# EAGLE design M784bad (EAGLE 6.6.0)
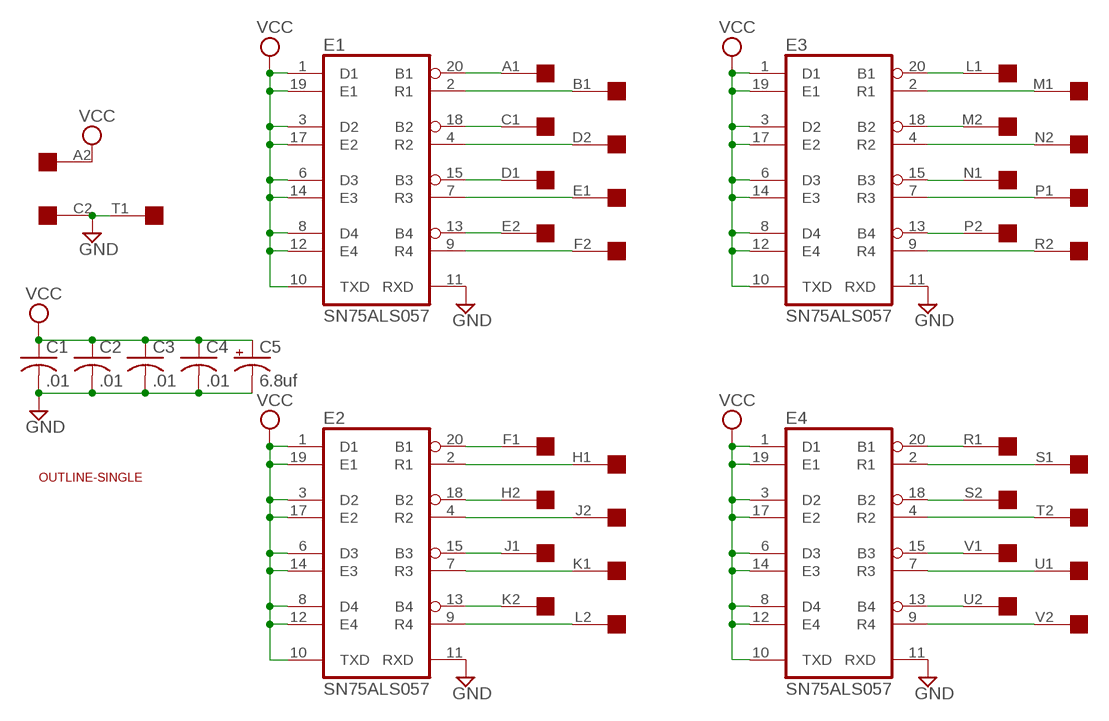
[diagram p0: schematic, sheet 1]

## Parts
C1  .01  C-US050-025X075  [C050-025X075]
C2  .01  C-US050-025X075  [C050-025X075]
C3  .01  C-US050-025X075  [C050-025X075]
C4  .01  C-US050-025X075  [C050-025X075]
C5  6.8uf  CPOL-USE15-5AXIAL  [E15-5]
E1  SN75ALS057  [DIL20]
E2  SN75ALS057  [DIL20]
E3  SN75ALS057  [DIL20]
E4  SN75ALS057  [DIL20]
U$1  SINGLE  [EDGE-CON2]
U$2  OUTLINE-SINGLE  [SINGLE]

## Nets
GND: C1.2 C2.2 C3.2 C4.2 C5.- E1.11(RXD) E2.11(RXD) E3.11(RXD) E4.11(RXD) U$1.C2 U$1.T1
N$1: E3.20(B1) U$1.L1
N$2: E3.2(R1) U$1.M1
N$3: E3.18(B2) U$1.M2
N$4: E3.4(R2) U$1.N2
N$5: E3.15(B3) U$1.N1
N$6: E3.7(R3) U$1.P1
N$7: E3.13(B4) U$1.P2
N$8: E3.9(R4) U$1.R2
N$9: E4.9(R4) U$1.V2
N$10: E4.13(B4) U$1.U2
N$11: E4.7(R3) U$1.U1
N$12: E4.15(B3) U$1.V1
N$13: E4.4(R2) U$1.T2
N$14: E4.18(B2) U$1.S2
N$15: E4.20(B1) U$1.R1
N$16: E4.2(R1) U$1.S1
N$17: E2.13(B4) U$1.K2
N$18: E2.9(R4) U$1.L2
N$19: E2.7(R3) U$1.K1
N$20: E2.15(B3) U$1.J1
N$21: E2.4(R2) U$1.J2
N$22: E2.18(B2) U$1.H2
N$23: E2.2(R1) U$1.H1
N$24: E2.20(B1) U$1.F1
N$25: E1.9(R4) U$1.F2
N$26: E1.13(B4) U$1.E2
N$27: E1.7(R3) U$1.E1
N$28: E1.15(B3) U$1.D1
N$29: E1.4(R2) U$1.D2
N$30: E1.18(B2) U$1.C1
N$31: E1.2(R1) U$1.B1
N$32: E1.20(B1) U$1.A1
VCC: C1.1 C2.1 C3.1 C4.1 C5.+ E1.1(D1) E1.3(D2) E1.6(D3) E1.8(D4) E1.10(TXD) E1.12(E4) E1.14(E3) E1.17(E2) E1.19(E1) E2.1(D1) E2.3(D2) E2.6(D3) E2.8(D4) E2.10(TXD) E2.12(E4) E2.14(E3) E2.17(E2) E2.19(E1) E3.1(D1) E3.3(D2) E3.6(D3) E3.8(D4) E3.10(TXD) E3.12(E4) E3.14(E3) E3.17(E2) E3.19(E1) E4.1(D1) E4.3(D2) E4.6(D3) E4.8(D4) E4.10(TXD) E4.12(E4) E4.14(E3) E4.17(E2) E4.19(E1) U$1.A2
Unconnected: U$1.B2

## Power pins joined to a net without a drawn wire
GND: E1.16(GND) E2.16(GND) E3.16(GND) E4.16(GND)
VCC: E1.5(VCC) E2.5(VCC) E3.5(VCC) E4.5(VCC)

## Library data of the parts
C1-C4 = rcl:C-US: CAPACITOR, American symbol
C5 = rcl:CPOL-US: POLARIZED CAPACITOR, American symbol
E1-E4 = dec-con:SN75ALS057: Qbus-likeTransceiver
U$1 = dec-con:SINGLE: Single-Height DEC board
U$2 = dec-con:OUTLINE-*: Board outlines for DEC boards.

## Board
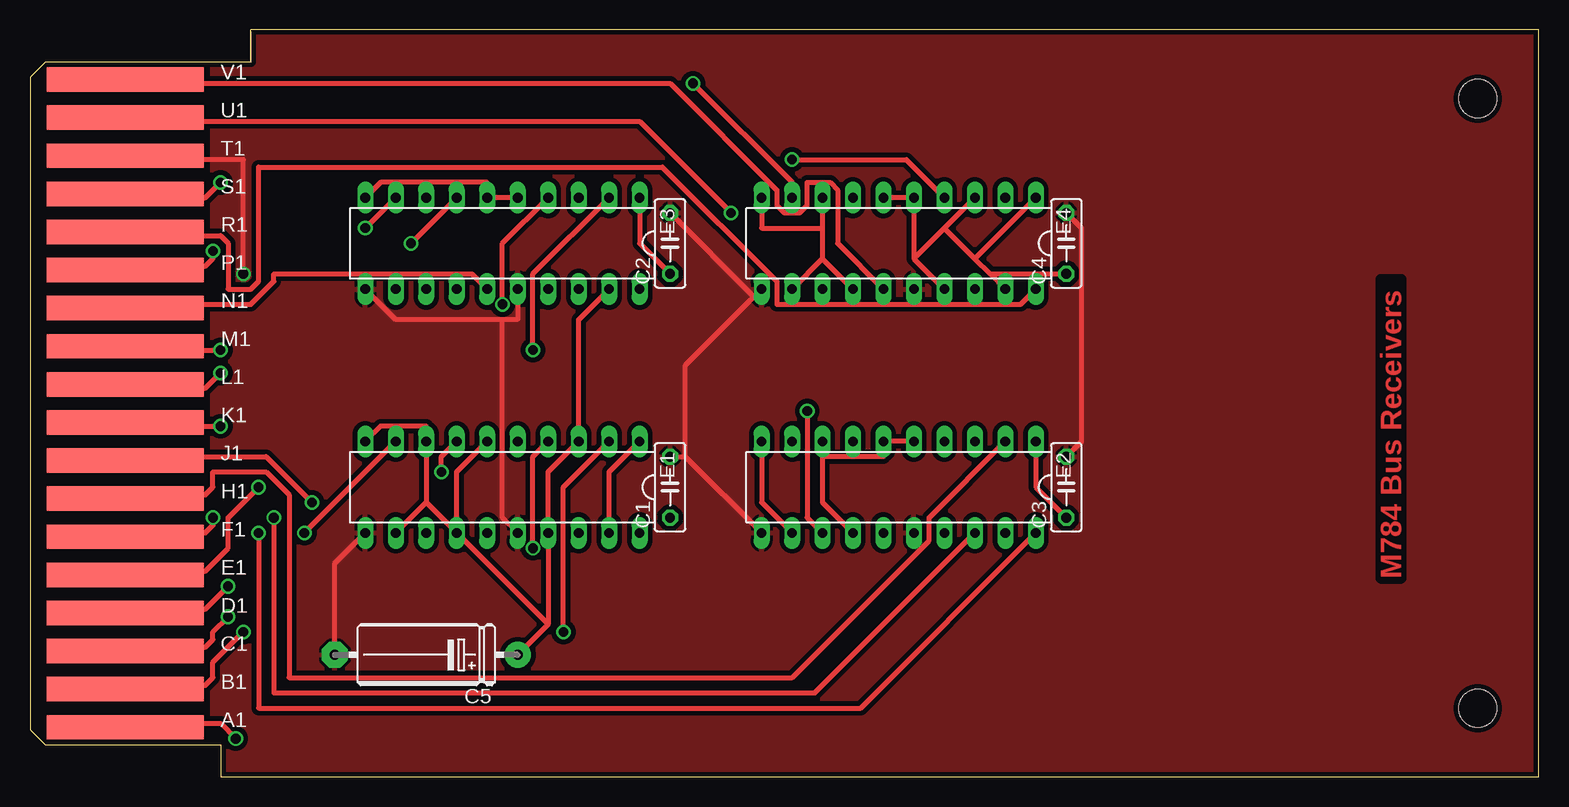
[diagram p1: board, top side]
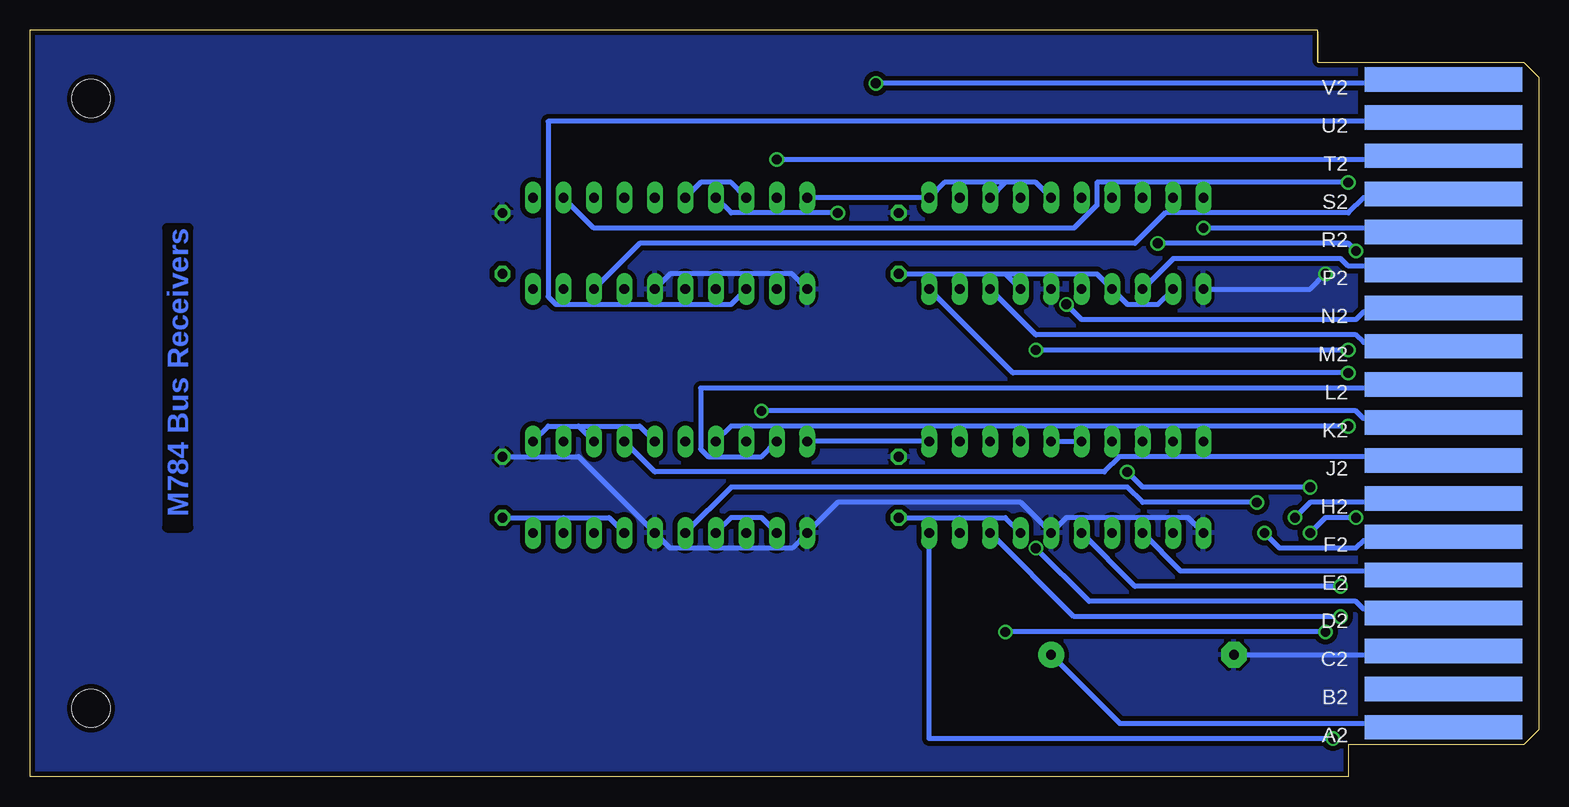
[diagram p2: board, bottom side, seen from below]

Size 125.73 x 62.23 mm. Coordinates in mm from the lower left corner, seen from the top.
Copper layers (1+16): Top 0.035mm / dielectric 1.5mm / Bottom 0.035mm
Design rules "16mils": minimum track width 16mil, minimum drill 32mil, track to track 15mil, track to pad 10mil, pad to pad 10mil, via to via 10mil, smd to smd 10mil, copper to edge 13mil, drill to drill 10mil, minimum pad ring 10mil, minimum via ring 8mil, stop-mask expansion 0mil, vias tented up to drill 0mil, thermal gap 10mil

### Footprints (pad centres in the part's own frame; a part is rotated, then mirrored left to right if it is on the bottom)
C050-025X075 = drill 0.813 octagon: 1 -2.54,0; 2 2.54,0
E15-5 = drill 0.813 pad 2.159: + -7.62,0 | drill 0.813 pad 2.159 octagon: - 7.62,0
DIL20 = drill 0.813 long: 1 -8.89,-3.81; 2 -6.35,-3.81; 3 -3.81,-3.81; 4 -1.27,-3.81; 5 1.27,-3.81; 6 3.81,-3.81; 7 6.35,-3.81; 8 8.89,-3.81; 9 11.43,-3.81; 10 13.97,-3.81; 11 13.97,3.81; 12 11.43,3.81; 13 8.89,3.81; 14 6.35,3.81; 15 3.81,3.81; 16 1.27,3.81; 17 -1.27,3.81; 18 -3.81,3.81; 19 -6.35,3.81; 20 -8.89,3.81
EDGE-CON2 = smd 13.106 x 2.032: A1 7.938,4.128; B1 7.938,7.303; C1 7.938,10.477; D1 7.938,13.652; E1 7.938,16.828; F1 7.938,20.003; H1 7.938,23.177; J1 7.938,26.352; K1 7.938,29.527; L1 7.938,32.703; M1 7.938,35.877; N1 7.938,39.053; P1 7.938,42.227; R1 7.938,45.403; S1 7.938,48.578; T1 7.938,51.752; U1 7.938,54.928; V1 7.938,58.102 | smd 13.106 x 2.032 bottom: A2 7.938,4.128; B2 7.938,7.303; C2 7.938,10.477; D2 7.938,13.652; E2 7.938,16.828; F2 7.938,20.003; H2 7.938,23.177; J2 7.938,26.352; K2 7.938,29.527; L2 7.938,32.703; M2 7.938,35.877; N2 7.938,39.053; P2 7.938,42.227; R2 7.938,45.403; S2 7.938,48.578; T2 7.938,51.752; U2 7.938,54.928; V2 7.938,58.102
SINGLE = hole 3.175: 120.65,56.515; 120.65,5.715

### Placement (x,y rotation side)
C1  53.34,24.13 90 top
C2  53.34,44.45 90 top
C3  86.36,24.13 90 top
C4  86.36,44.45 90 top
C5  33.02,10.16 180 top
E1  41.91,24.13 180 top
E2  74.93,24.13 180 top
E3  41.91,44.45 180 top
E4  74.93,44.45 180 top
U$1  0,0 0 top
U$2  0,0 0 top

### Tracks (layer width: path | path; a pad name or v marks a point on that pad's centre or on a via)
GND  (via drill 0.81)
  Top 0.406: C4.2 87.63,45.72 87.63,27.94 C3.2 | 54.61,26.67 E2.11 | C1.2 54.61,26.67 | 60.33,40.01 54.61,34.29 54.61,26.67 | 60.33,40.01 E4.11 | 60.33,40.01 C2.2 | E3.11 30.48,38.1 39.37,38.1 | 39.37,38.1 40.64,38.1 E3.16 | E1.11 25.4,17.78 C5.- | 39.37,38.1 39.37,21.59 E1.16 | v17.78,41.91 17.78,51.44 8.26,51.44 U$1.T1
  Bottom 0.406: C3.2 80.01,26.67 E2.16 72.39,19.05 62.23,19.05 E2.11 58.42,22.86 43.18,22.86 E1.16 39.37,21.59 29.21,21.59 E1.11 | E4.16 72.39,41.91 62.23,41.91 E4.11 | C5.- 8.26,10.16 U$1.C2 | v17.78,41.91 19.05,40.64 E3.11
  pour Top (isolate 0.406): 15.24,62.23 125.73,62.23 125.73,0 15.24,0
  pour Bottom (isolate 0.406): 15.24,62.23 125.73,62.23 125.73,0 15.24,0
N$1  (via drill 0.81)
  Top 0.406: v15.88,33.66 14.61,32.38 8.26,32.38 U$1.L1
  Bottom 0.406: E3.20 43.82,33.66 v15.88,33.66
N$2  (via drill 0.81)
  Top 0.406: E3.2 41.91,41.91 v41.91,35.56 | v15.88,35.56 8.26,35.56 U$1.M1
  Bottom 0.406: v15.88,35.56 v41.91,35.56
N$3
  Bottom 0.406: E3.18 41.91,36.83 15.24,36.83 14.61,36.2 8.26,36.2 U$1.M2
N$4  (via drill 0.81)
  Top 0.406: E3.4 39.37,44.45 v39.37,39.37
  Bottom 0.406: v39.37,39.37 38.1,38.1 15.24,38.1 14.61,38.73 8.26,38.73 U$1.N2
N$5
  Top 0.406: E3.15 36.83,41.91 20.32,41.91 20.32,41.27 18.42,39.37 8.26,39.37 U$1.N1
N$6  (via drill 0.81)
  Top 0.406: v31.75,44.45 E3.7 | v15.24,43.81 15.24,43.18 14.61,42.55 8.26,42.55 U$1.P1
  Bottom 0.406: v31.75,44.45 15.88,44.45 v15.24,43.81
N$7
  Bottom 0.406: E3.13 30.48,43.18 16.51,43.18 15.88,42.55 8.26,42.55 U$1.P2
N$8  (via drill 0.81)
  Top 0.406: v27.94,45.72 E3.9
  Bottom 0.406: v27.94,45.72 8.26,45.72 U$1.R2
N$9  (via drill 0.81)
  Top 0.406: E4.9 63.5,49.53 v55.25,57.78
  Bottom 0.406: v55.25,57.78 8.26,57.78 U$1.V2
N$10
  Bottom 0.406: E4.13 67.31,39.37 81.92,39.37 82.55,40.01 82.55,54.61 8.26,54.61 U$1.U2
N$11  (via drill 0.81)
  Top 0.406: v58.42,46.99 50.8,54.61 8.26,54.61 U$1.U1
  Bottom 0.406: E4.7 67.31,46.99 v58.42,46.99
N$12
  Top 0.406: E4.15 67.31,44.45 67.31,48.9 66.68,49.53 64.77,49.53 64.77,47.62 64.14,46.99 62.87,46.99 62.23,47.62 62.23,48.9 53.34,57.78 8.26,57.78 U$1.V1
N$13  (via drill 0.81)
  Top 0.406: E4.4 73.03,51.44 v63.5,51.44
  Bottom 0.406: v63.5,51.44 8.26,51.44 U$1.T2
N$14
  Bottom 0.406: E4.18 74.93,44.45 33.66,44.45 31.12,46.99 15.88,46.99 14.61,48.26 8.26,48.26 U$1.S2
N$15
  Top 0.406: E4.20 82.55,39.37 62.23,39.37 62.23,41.27 52.71,50.8 19.05,50.8 19.05,41.27 18.42,40.64 16.51,40.64 16.51,44.45 15.88,45.09 8.26,45.09 U$1.R1
N$16  (via drill 0.81)
  Top 0.406: v15.88,49.53 14.61,48.26 8.26,48.26 U$1.S1
  Bottom 0.406: E4.2 78.74,45.72 38.74,45.72 36.83,47.62 36.83,49.53 v15.88,49.53
N$17  (via drill 0.81)
  Top 0.406: E2.13 64.77,21.59 v64.77,30.48
  Bottom 0.406: v64.77,30.48 15.24,30.48 14.61,29.84 8.26,29.84 U$1.K2
N$18
  Bottom 0.406: E2.9 64.77,26.67 69.22,26.67 69.85,27.3 69.85,32.38 8.26,32.38 U$1.L2
N$19  (via drill 0.81)
  Top 0.406: v15.88,29.21 8.26,29.21 U$1.K1
  Bottom 0.406: E2.7 67.31,29.21 v15.88,29.21
N$20  (via drill 0.81)
  Top 0.406: v23.5,22.86 19.69,26.67 8.26,26.67 U$1.J1
  Bottom 0.406: E2.15 67.31,24.13 34.29,24.13 33.02,22.86 v23.5,22.86
N$21
  Bottom 0.406: E2.4 73.66,25.4 36.2,25.4 34.93,26.67 8.26,26.67 U$1.J2
N$22  (via drill 0.81)
  Top 0.406: E2.18 65.41,6.99 20.32,6.99 v20.32,21.59
  Bottom 0.406: v20.32,21.59 19.05,22.86 8.26,22.86 U$1.H2
N$23
  Top 0.406: E2.2 74.93,21.59 74.93,19.68 63.5,8.26 21.59,8.26 21.59,23.5 19.69,25.4 15.24,25.4 15.24,24.13 14.61,23.5 8.26,23.5 U$1.H1
N$24  (via drill 0.81)
  Top 0.406: E2.20 69.22,5.71 19.05,5.71 v19.05,20.32 | v15.24,21.59 15.24,20.95 14.61,20.32 8.26,20.32 U$1.F1
  Bottom 0.406: v19.05,20.32 17.78,21.59 v15.24,21.59
N$25  (via drill 0.81)
  Top 0.406: v22.86,20.32 E1.9
  Bottom 0.406: v22.86,20.32 21.59,19.05 15.24,19.05 14.61,19.68 8.26,19.68 U$1.F2
N$26
  Bottom 0.406: E1.13 29.85,17.14 8.26,17.14 U$1.E2
N$27  (via drill 0.81)
  Top 0.406: E1.7 34.29,26.67 v34.29,25.4 | v19.05,24.13 16.51,21.59 16.51,19.05 14.61,17.14 8.26,17.14 U$1.E1
  Bottom 0.406: v34.29,25.4 33.02,24.13 v19.05,24.13
N$28  (via drill 0.81)
  Top 0.406: v16.51,15.88 14.61,13.97 8.26,13.97 U$1.D1
  Bottom 0.406: E1.15 33.66,15.88 v16.51,15.88
N$29  (via drill 0.81)
  Top 0.406: E1.4 41.91,26.67 v41.91,19.05
  Bottom 0.406: v41.91,19.05 37.47,14.61 15.24,14.61 14.61,13.97 8.26,13.97 U$1.D2
N$30  (via drill 0.81)
  Top 0.406: v16.51,13.34 15.24,12.06 15.24,11.43 14.61,10.79 8.26,10.79 U$1.C1
  Bottom 0.406: E1.18 38.74,13.34 v16.51,13.34
N$31  (via drill 0.81)
  Top 0.406: E1.2 44.45,24.13 v44.45,12.06 | v17.78,12.06 15.24,9.53 15.24,8.26 14.61,7.62 8.26,7.62 U$1.B1
  Bottom 0.406: v17.78,12.06 v44.45,12.06
N$32  (via drill 0.81)
  Top 0.406: v17.15,3.17 15.88,4.45 8.26,4.45 U$1.A1
  Bottom 0.406: E1.20 50.8,3.17 v17.15,3.17
VCC
  Top 0.406: E4.6 E4.5 73.66,43.18 | 73.66,43.18 E4.17 | 73.66,43.18 76.2,45.72 | 76.2,45.72 E4.3 | 76.2,45.72 78.74,43.18 | 78.74,43.18 80.01,41.91 | 80.01,41.91 E4.19 | 78.74,43.18 E4.1 | 80.01,41.91 C4.1 | 66.04,43.18 E4.12 | E4.8 66.04,45.72 | 66.04,45.72 66.04,43.18 | 66.04,43.18 E4.14 | E3.10 29.21,49.53 33.02,49.53 | E3.8 33.02,49.53 | E3.5 E3.6 38.1,49.53 33.02,49.53 | 66.04,45.72 60.96,45.72 E4.10 | C2.1 50.8,44.45 E3.1 | E2.14 66.04,22.86 66.04,26.67 | E2.8 66.04,26.67 | E2.5 E2.6 71.12,26.67 66.04,26.67 | C3.1 83.82,24.13 E2.1 | 33.02,22.86 E1.12 | 33.02,22.86 E1.8 33.02,29.21 29.21,29.21 E1.10 | 33.02,22.86 E1.14 | E1.6 35.56,25.4 E1.14 | E2.12 60.96,22.86 E2.10 | E1.1 48.26,25.4 E1.19 | 43.18,12.7 C5.+ | 43.18,12.7 E1.17 43.18,25.4 E1.3 45.72,38.1 E3.19 | 43.18,12.7 E1.14
  Bottom 0.406: E3.12 31.75,39.37 34.29,39.37 E3.14 36.83,41.91 44.45,41.91 | 44.45,41.91 E3.17 | C2.1 48.26,41.91 | 48.26,41.91 44.45,41.91 | 48.26,41.91 E3.19 | 44.45,49.53 E3.3 | 44.45,49.53 41.91,49.53 E3.5 | 44.45,49.53 49.53,49.53 E3.1 E4.10 | E4.6 69.85,49.53 67.31,49.53 E4.8 | E2.17 77.47,21.59 81.28,21.59 | C3.1 81.28,21.59 | 81.28,21.59 E2.19 | 80.01,29.21 E2.3 | 80.01,29.21 82.55,29.21 E2.1 | E2.5 74.93,29.21 80.01,29.21 | E1.5 E1.6 | E1.17 44.45,21.59 48.26,21.59 | C1.1 48.26,21.59 | 48.26,21.59 E1.19 | E1.1 E2.10 | E2.14 67.31,21.59 64.77,21.59 E2.12 | C5.+ 34.93,4.45 8.26,4.45 U$1.A2

### Text on the board
Top: M784 Bus Receivers
Bottom: M784 Bus Receivers